# Altium schematic sheet RF Detector CD.SchDoc
size A4
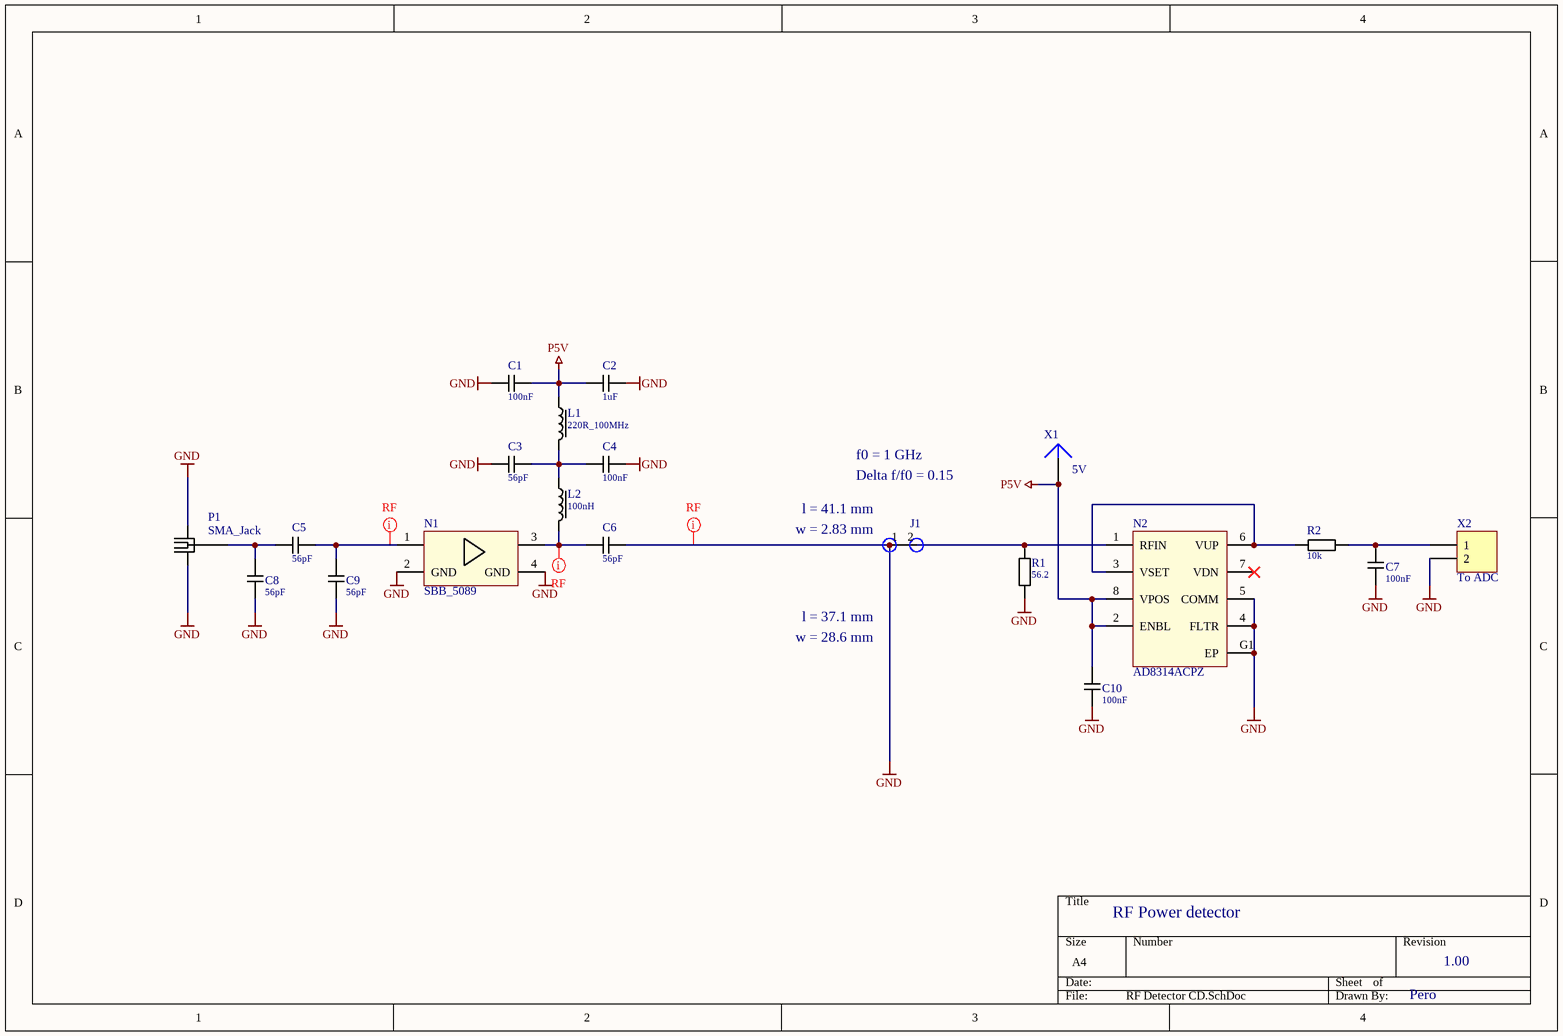
[diagram p0: RF Detector CD.SchDoc]

## Parts
C1  100nF  [CAPC1608X90A]
C2  1uF  [CAPC2012X125N]
C3  56pF  [CAPC1608X90A]
C4  100nF  [CAPC1608X90A]
C5  56pF  [CAPC1608X90A]
C6  56pF  [CAPC1608X90A]
C7  100nF  [CAPC1608X90A]
C8  56pF  [CAPC1608X90A]
C9  56pF  [CAPC1608X90A]
C10  100nF  [CAPC1608X90A]
J1  (no value)  [SMDCUT_2_0.3_1.27_-_RR]  (net tie, no BOM)
L1  220R_100MHz  [INDC1608X90A]
L2  100nH  [INDP1609X94L]
N1  SBB_5089  [SMD_SOT89-4_4.6x4.25_1.5]
N2  AD8314ACPZ  [ANALOG_LFCSP_VD_CP-8-1TN]
P1  SMA_Jack  [SMA_Jack_7x7x14mm]
R1  56.2  [RESC1608X45A]
R2  10k  [RESC1608X45A]
X1  5V  [PIN1]
X2  To ADC  [HDR1X2]

## Nets
GND: C1.1 C2.2 C3.1 C4.2 C6.2 C7.2 C8.2 C9.1 C10.2 J1.1 N1.2(GND) N1.4(GND) N2.4(FLTR) N2.5(COMM) N2.G1(EP) P1.2(GND) P1.3(GND) R1.2 X2.2
P5V: C1.2 C2.1 C10.1 L1.1 N2.2(ENBL) N2.8(VPOS) X1.1
NetC3_2: C3.2 C4.1 L1.2 L2.1
NetC5_1: C5.1 C8.1 P1.1(SMA)
NetC5_2: C5.2 C9.2 N1.1
NetC6_1: C6.1 L2.2 N1.3
NetC7_1: C7.1 R2.2 X2.1
NetJ1_2: J1.2 N2.1(RFIN) R1.1
NetN2_3: N2.3(VSET) N2.6(VUP) R2.1

Not connected (* = marked no-connect by the designer): N2 7(VDN)*

## Layout directives
net class RF: GND, NetC5_2, NetC6_1

## Notes on the sheet
- (near J1) l = 41.1 mm
- f0 = 1 GHz
- Delta f/f0 = 0.15
- (near J1) w = 2.83 mm
- w = 28.6 mm
- l = 37.1 mm
- RF Power detector
- 1.00
- Pero

## Library data of the parts
C1 C4 C7 C10 = v39350-z2104-k2: KERKO 0603 100N 50V 10% X7R; SIMEA_PN: A2B00017537; Zollner_PN: 1635246-00; Comp_Subgroup: C-cer; Temperature_Range_Min: -55; Temperature_Range_Max: 125; Comp_Type: Standard; Vendor0: MURATA; Vendor0_Series: GRM; Vendor0_Order_Number: GRM188R71H104KA93D; Vendor0_Package: C0603; Status_Name: AM; Part_Number: v39350-z2104-k2; Value: 100nF; Voltage: 50V; Tolerance: 10%; Dielectric: X7R; Package: C0603; RoHS compliant: yes; Status: 10; Status_Date: 2014.04.17.; Creator: AM; Creation_date: 2014.04.17.; HelpURL: http://www.murata.com/; ComponentLink1Description: [Murata]-[Capacitor-chip]\[DS]-[xx-2013-09]; ComponentLink1URL: B:\DocLib\[Murata]-[Capacitor-chip]\[DS]-[xx-2013-09]\c02e.pdf
C2 = v39351-z105-k2: KERKO 0805 1U 16V 5% X7R; SIMEA_PN: ESP00075; Zollner_PN: 1634424-00; Comp_Subgroup: C-cer; Temperature_Range_Min: -55; Temperature_Range_Max: 125; Comp_Type: Standard; Vendor0: KEMET; Vendor0_Series: CX7R; Vendor0_Order_Number: C0805C105J4RAC; Vendor0_Package: C0805; Status_Name: AM; Part_Number: v39351-z105-k2; Value: 1uF; Voltage: 16V; Tolerance: 5%; Dielectric: X7R; Package: C0805; RoHS compliant: yes; Status: 10; Status_Date: 2014.04.17.; Creator: AM; Creation_date: 2014.04.17.; HelpURL: http://www.kemet.com/; ComponentLink1Description: [Kemet]-[Capacitor-C-X7R]\[DS]-[xx-2013-12]; ComponentLink1URL: B:\DocLib\[Kemet]-[Capacitor-C-X7R]\[DS]-[xx-2013-12]\KEM_C1002_X7R_SMD.pdf
C3 C5 C6 C8 C9 = ATC:600S560FT250XT: KERKO 0603 56P 250V +-1% C0G; Comp_Subgroup: C-cer; Tolerance: 1%; Dielectric: NP0; Temperature_Range_Min: -55; Temperature_Range_Max: 125; Comp_Type: Standard; Vendor0: ATC; Vendor0_Series: 600; Vendor0_Package: C0603; Status_Name: AM; Part_Number: ATC:600S560FT250XT; Value: 56pF; Voltage: 250V; Package: C0603; RoHS compliant: yes; Vendor0_Order_Number: 600S560FT250XT; Status: 0; Status_Date: 15.04.2014; Creator: AM; Creation_date: 15.04.2014; HelpURL: http://www.atceramics.com/; ComponentLink1Description: [ATC]-[Capacitor_600]\[DS]-[R-2009-12]; ComponentLink1URL: B:\DocLib\[ATC]-[Capacitor_600]\[DS]-[R-2009-12]\600s.pdf
J1 = CUTSMD-WIDTH0.3MM: Special SMD Cut component; Part_Number: CUTSMD-WIDTH0.3MM
L1 = v50010-g96-a1: FERRIT 0603 220R 100MHZ 2A DCR=0R05; Commercial_Part: BLM18EG221SN1D; SIMEA_PN: ESP00100; Zollner_PN: 1634286-00; Comp_Subgroup: L-fb; Tolerance: 25%; Temperature_Range_Min: -55; Temperature_Range_Max: 125; Comp_Type: Standard; Vendor0: MURATA; Vendor0_Series: BLM18EG; Vendor0_Package: C0603; Status_Name: AM; Part_Number: v50010-g96-a1; Value: 220R_100MHz; Rating: 2A; Package: C0603; RoHS compliant: yes; Vendor0_Order_Number: BLM18EG221SN1D; Status: 0; Status_Date: 2014.04.22.; Creator: AM; Creation_date: 2014.04.22.; HelpURL: http://www.murata.com; ComponentLink1Description: [Murata]-[Ferrite-chip]\[DS]-[xx-2013-08]; ComponentLink1URL: B:\DocLib\[Murata]-[Ferrite-chip]\[DS]-[xx-2013-08]\c31e.pdf
L2 = v50010-g27-a5: DROSSEL SMD 0603 100N 0A22 2%; Commercial_Part: LQW18ANR10G00D; SIMEA_PN: ESP00107; Zollner_PN: 1634269-00; Comp_Subgroup: L; Rating: 220mA; Temperature_Range_Min: -55; Temperature_Range_Max: 125; Comp_Type: Standard; Vendor0: MURATA; Vendor0_Series: LQW18AN; Vendor0_Package: C0603W; Status_Name: AM; Part_Number: V50010-G27-A5; Value: 100nH; Tolerance: 2%; Package: C0603W; RoHS compliant: yes; Vendor0_Order_Number: LQW18ANR10G00D; Status: 0; Status_Date: 2014.04.22.; Creator: AM; Creation_date: 2014.04.22.; HelpURL: http://www.murata.com; ComponentLink1Description: [Murata]-[Inductor-chip]\[DS]-[xx-2013-05]; ComponentLink1URL: B:\DocLib\[Murata]-[Inductor-chip]\[DS]-[xx-2013-05]\o05e.pdf
N1 = SIRENZA:SBB_5089: 50MHz to 6000MHz, CASCADABLE ACTIVE BIAS InGaP HBT MMIC AMPLIFIER; Value: 50MHz to 6GHz; SIMEA_PN: ESP00139; Zollner_PN: 1633917-00; Rating: 20dB; Temperature_Range_Min: -40; Temperature_Range_Max: 85; Comp_Type: Standard; Vendor0: rfmd; Vendor0_Order_Number: SBB5089Z; Vendor0_Package: SOT89; Status_Name: AM; Part_Number: SIRENZA:SBB_5089; Commercial_Part: SBB_5089; Package: SOT89; RoHS compliant: yes; Status: 0; Status_Date: 2014.04.12.; Creator: AM; Creation_date: 2014.04.12.; HelpURL: http://www.rfmd.com; ComponentLink1Description: [rfmd]-[SBB5089]\[DS]-[xx-2013-07]; ComponentLink1URL: B:\DocLib\[rfmd]-[SBB5089]\[DS]-[xx-2013-07]\SBB5089ZDS.pdf
N2 = ANALOG_DEVICES:AD8314ACP: 100 MHz to 2.7 GHz, 45 dB RF Detector/Controller; Value: -58dBV..-13dBV; SIMEA_PN: ESP00011; Zollner_PN: 1634892-00; Temperature_Range_Min: -40; Temperature_Range_Max: 85; Comp_Type: Standard; Vendor0: Analog Devices; Vendor0_Package: CP-8-1; Status_Name: AM; Part_Number: ANALOG_DEVICES:AD8314ACP; Commercial_Part: AD8314ACPZ; Package: LFCSP8; RoHS compliant: yes; Vendor0_Order_Number: AD8314ACPZ; Status: 0; Status_Date: 2014.04.12.; Creator: AM; Creation_date: 2014.04.12.; HelpURL: http://www.analog.com; ComponentLink1Description: [Analog_Devices]-[AD8314]\[DS]-[B-2006-00]; ComponentLink1URL: B:\DocLib\[Analog_Devices]-[AD8314]\[DS]-[B-2006-00]\AD8314.pdf
P1 = RSCOMPONENTS:SMA_Jack: SMA Jack edge mounted; Comp_Subgroup: con-RF; Access_Direction: RA; Gender: F; Temperature_Range_Min: -40; Temperature_Range_Max: 90; Comp_Type: Standard; Vendor0_Order_Number: 526-5757; Status_Name: AM; Part_Number: RSCOMPONENTS:SMA_Jack; Commercial_Part: SMA_JACK; Value: SMA; Package: SMD; RoHS compliant: yes; Vendor0: RSCOMPONENTS; Status: 100; Status_Date: 22.05.2015; Creator: HD; Creation_date: 21.05.2015
R1 = v39244-z5560-f200: WID CHIP 0603 56R2 1% TK100; SIMEA_PN: ESP00207; Zollner_PN: 1633594-00; Comp_Subgroup: R; Rating: 0.1; Temperature_coefficient: 100ppm; Temperature_Range_Min: -55; Temperature_Range_Max: 155; Comp_Type: Standard; Vendor0: VISHAY; Vendor0_Series: D/CRCW-Pe3; Vendor0_Order_Number: CRCW060356R2FKEA; Vendor0_Package: C0603; Status_Name: AM; Part_Number: v39244-z5560-f200; Value: 56.2; Tolerance: 1%; Package: C0603; RoHS compliant: yes; Status: 10; Status_Date: 2014.04.17.; HelpURL: http://www.vishay.com/; ComponentLink1Description: [Vishay]-[Resistor-DCRCWpe3]\[DS]-[xx-2014-04]; ComponentLink1URL: B:\DocLib\[Vishay]-[Resistor-DCRCWpe3]\[DS]-[xx-2014-04]\dcrcwpe3.pdf
R2 = v39244-z5103-f: WID CHIP 0603 10K 1% TK100; SIMEA_PN: A2B00000777; Zollner_PN: 1635358-00; Comp_Subgroup: R; Rating: 0.1; Temperature_coefficient: 100ppm; Temperature_Range_Min: -55; Temperature_Range_Max: 155; Comp_Type: Standard; Vendor0: VISHAY; Vendor0_Series: D/CRCW-Pe3; Vendor0_Order_Number: CRCW060310K0FKEA; Vendor0_Package: C0603; Status_Name: AM; Part_Number: v39244-z5103-f; Value: 10k; Tolerance: 1%; Package: C0603; RoHS compliant: yes; Status: 10; Status_Date: 2014.04.17.; HelpURL: http://www.vishay.com/; ComponentLink1Description: [Vishay]-[Resistor-DCRCWpe3]\[DS]-[xx-2014-04]; ComponentLink1URL: B:\DocLib\[Vishay]-[Resistor-DCRCWpe3]\[DS]-[xx-2014-04]\dcrcwpe3.pdf
X1 = Plug: LatestRevisionDate: 17-Jul-2002; LatestRevisionNote: Re-released for DXP Platform.; Publisher: Altium Limited
X2 = Header 2: Header, 2-Pin; LatestRevisionDate: 17-Jul-2002; LatestRevisionNote: Re-released for DXP Platform.; Publisher: Altium Limited